# Altium schematic sheet mcu.SchDoc
size A4
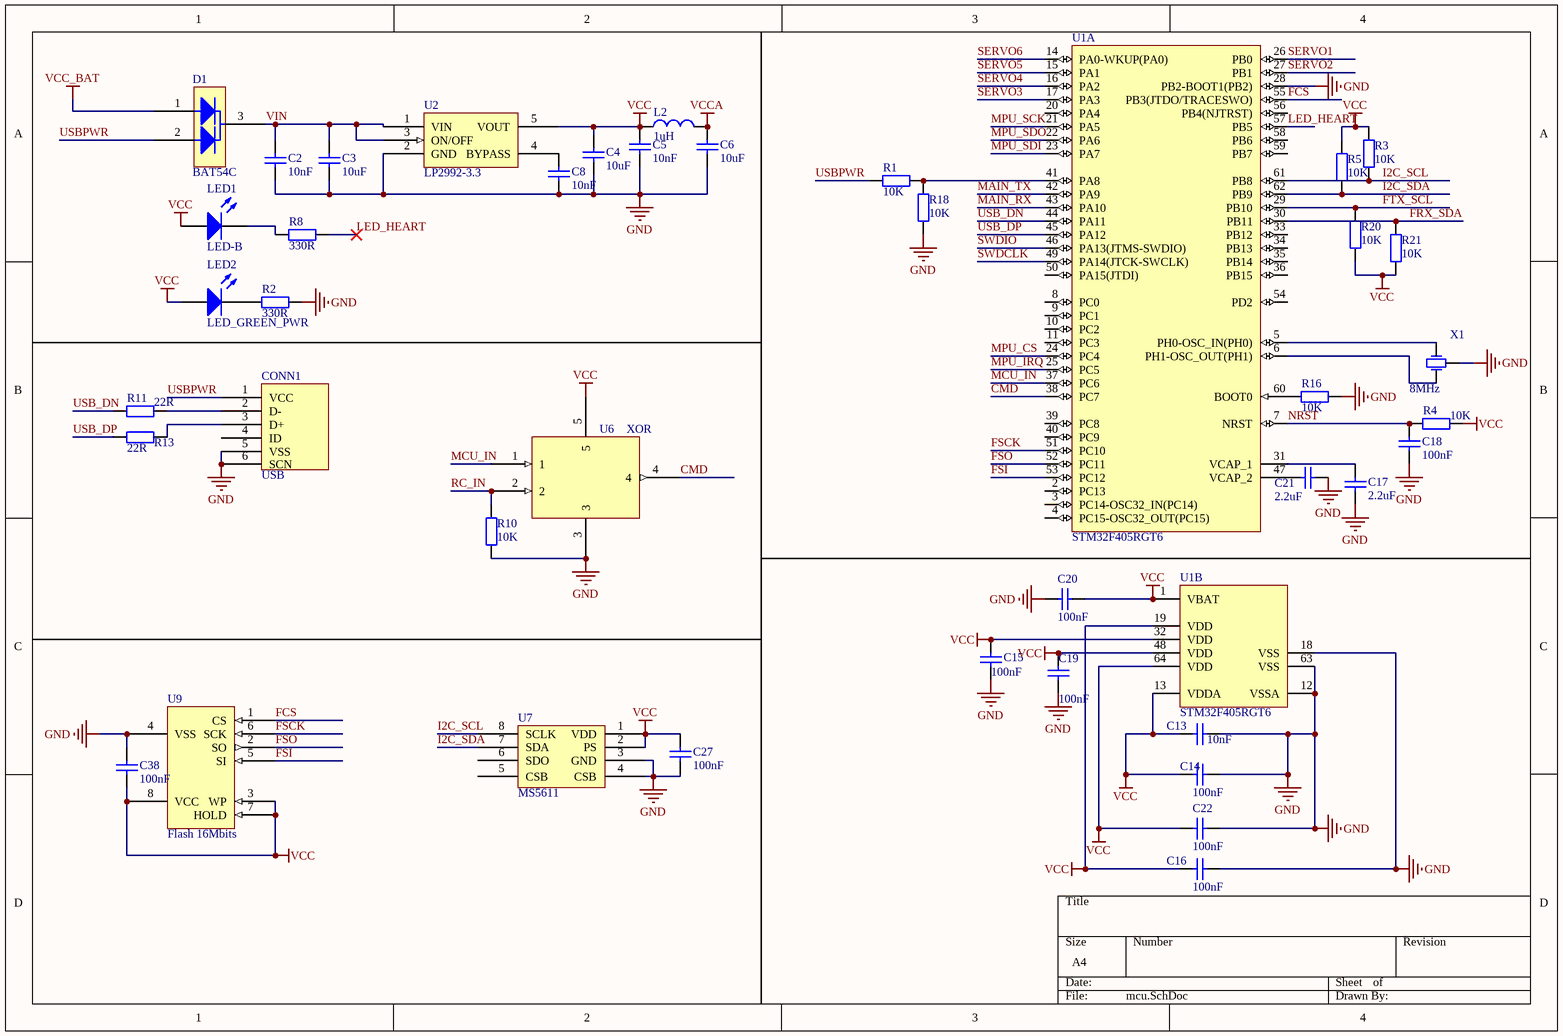
[diagram p0: mcu.SchDoc]

## Parts
C2  10nF  [0402C]
C3  10uF  [0805-1]
C4  10uF  [0805-1]
C5  10nF  [0402C]
C6  10uF  [0805-1]
C8  10nF  [0402C]
C13  10nF  [0402C]
C14  100nF  [0402C]
C15  100nF  [0402C]
C16  100nF  [0402C]
C17  2.2uF  [0402C]
C18  100nF  [0402C]
C19  100nF  [0402C]
C20  100nF  [0402C]
C21  2.2uF  [0402C]
C22  100nF  [0402C]
C27  100nF  [0402C]
C38  100nF  [0402C]
CONN1  USB  [USB_MIC_h]
D1  BAT54C  [SOT23]
L2  1uH  [L0603]
LED1  LED-B  [0402LED B]
LED2  LED_GREEN_PWR  [0402LED G]
R1  10K  [0402R]
R2  330R  [0402R]
R3  10K  [0402R]
R4  10K  [0402R]
R5  10K  [0402R]
R8  330R  [0402R]
R10  10K  [0402R]
R11  22R  [0402R]
R13  22R  [0402R]
R16  10K  [0402R]
R18  10K  [0402R]
R20  10K  [0402R]
R21  10K  [0402R]
U1  STM32F405RGT6  [STM-LQFP64_N]  (parts A,B of 2)
U2  LP2992-3.3  [SOT-23-5L]
U6  XOR  [SC70-5]
U7  MS5611  [MS5611-01BA]
U9  Flash 16Mbits  [SO8_N]
X1  8MHz  [XTAL3215]

## Nets
GND: C2.1 C3.1 C4.1 C5.1 C6.1 C8.1 C13.2 C14.2 C15.1 C16.2 C17.1 C18.1 C19.1 C20.1 C21.2 C22.2 C27.1 C38.2 CONN1.5(VSS) CONN1.6(SCN) R2.2 R10.1 R16.2 R18.1 U1.12(VSSA) U1.18(VSS) U1.28(PB2-BOOT1(PB2)) U1.63(VSS) U2.2(GND) U6.3 U7.3(GND) U7.4(CSB) U9.4(VSS) X1.2(GND)
VCC: C4.2 C5.2 C13.1 C14.1 C15.2 C16.1 C19.2 C20.2 C22.1 C27.2 C38.1 L2.1 LED1.1(A) LED2.1(A) R3.2 R4.2 R5.2 R20.1 R21.1 U1.1(VBAT) U1.13(VDDA) U1.19(VDD) U1.32(VDD) U1.48(VDD) U1.64(VDD) U2.5(VOUT) U6.5 U7.1(VDD) U7.2(PS) U9.3(WP) U9.7(HOLD) U9.8(VCC)
VCC_BAT: D1.1
VCCA: C6.2 L2.2
CMD: U1.38(PC7) U6.4
FCS: U1.55(PB3(JTDO/TRACESWO)) U9.1(CS)
FRX_SDA: R21.2 U1.30(PB11)
FSCK: U1.51(PC10) U9.6(SCK)
FSI: U1.53(PC12) U9.5(SI)
FSO: U1.52(PC11) U9.2(SO)
FTX_SCL: R20.2 U1.29(PB10)
I2C_SCL: R3.1 U1.61(PB8) U7.8(SCLK)
I2C_SDA: R5.1 U1.62(PB9) U7.7(SDA)
LED_HEART: R8.1 U1.57(PB5)
MAIN_RX: U1.43(PA10)
MAIN_TX: U1.42(PA9)
MCU_IN: U1.37(PC6) U6.1
MPU_CS: U1.24(PC4)
MPU_IRQ: U1.25(PC5)
MPU_SCK: U1.21(PA5)
MPU_SDI: U1.23(PA7)
MPU_SDO: U1.22(PA6)
NRST: C18.2 R4.1 U1.7(NRST)
RC_IN: R10.2 U6.2
SERVO1: U1.26(PB0)
SERVO2: U1.27(PB1)
SERVO3: U1.17(PA3)
SERVO4: U1.16(PA2)
SERVO5: U1.15(PA1)
SERVO6: U1.14(PA0-WKUP(PA0))
SWDCLK: U1.49(PA14(JTCK-SWCLK))
SWDIO: U1.46(PA13(JTMS-SWDIO))
USB_DN: R11.1 U1.44(PA11)
USB_DP: R13.1 U1.45(PA12)
USBPWR: CONN1.1(VCC) D1.2 R1.1
VIN: C2.2 C3.2 D1.3 U2.1(VIN) U2.3(ON/OFF)
NetC8_2: C8.2 U2.4(BYPASS)
NetC17_2: C17.2 U1.31(VCAP_1)
NetC21_1: C21.1 U1.47(VCAP_2)
NetCONN1_2: CONN1.2(D-) R11.2
NetCONN1_3: CONN1.3(D+) R13.2
NetLED1_2: LED1.2(K) R8.2
NetLED2_2: LED2.2(K) R2.1
NetR1_2: R1.2 R18.2 U1.41(PA8)
NetR16_1: R16.1 U1.60(BOOT0)
NetU1_5: U1.5(PH0-OSC_IN(PH0)) X1.3(OSC2)
NetU1_6: U1.6(PH1-OSC_OUT(PH1)) X1.1(OSC1)

Not connected (* = marked no-connect by the designer): CONN1 4(ID); U1 2(PC13) 3(PC14-OSC32_IN(PC14)) 4(PC15-OSC32_OUT(PC15)) 8(PC0) 9(PC1) 10(PC2) 11(PC3) 20(PA4) 33(PB12) 34(PB13) 35(PB14) 36(PB15) 39(PC8) 40(PC9) 50(PA15(JTDI)) 54(PD2) 56(PB4(NJTRST)) 58(PB6) 59(PB7); U7 5(CSB) 6(SDO)

## Library data of the parts
C2-C6 C8 C13-C22 C27 C38 = cap: 贴片电阻
CONN1 = USB-MIC: USB Micro USB R/A Type B
D1 = BAT54C: Dual Diode Command Cathode BAT54C
L2 = inducer: 贴片电感
LED1 = LED-B: LED-BLUE
LED2 = LED_GREEN: 绿色led
R1-R5 R8 R10 R11 R13 R16 R18 R20 R21 = Res-0402: 贴片电阻
U1 = STM32F405RGT6: ARM Cortex-M4 32-bit MCU+FPU, 210 DMIPS, 1024 kB Flash, 192 kB Internal RAM, 51 I/Os, 64-pin LQFP, -40 to 85 degC, Tray; Manufacturer: STMicroelectronics; D/A Converter: 2x12-bit; FLASH Size (Prog) (kB): 1024; I/Os (High Current): 51; Internal RAM Size (kB): 192; Operating Frequency(F) (Processor speed) (MHz): 168; Supply Voltage(Vcc) max (V): 3.6; Supply Voltage(Vcc) min (V): 1.8; DatasheetVersion: Rev. 4; PackageVersion: Rev. 4, 06/2013; PackageReference: LQFP64; PackageDescription: 64-Pin Low Profile Quad Flat Package, 10 x 10 mm Body, 0.5 mm Pitch; Supplier 1: Digi-Key; Supplier Part Number 1: 497-11767-ND; Supplier 2: Farnell; Supplier Part Number 2: 2064363; Supplier 3: Newark; Supplier Part Number 3: 73T2329; Supplier 4: Mouser; Supplier Part Number 4: 511-STM32F405RGT6; Core: ARM Cortex-M4; Packing: Tray; Mounting Technology: Surface Mount; PartNumber: STM32F405RGT6; ComponentLink1Description: Manufacturer URL; ComponentLink1URL: http://www.st.com/web/en/home.html; ComponentLink2Description: Datasheet; ComponentLink2URL: http://www.st.com/st-web-ui/static/active/en/resource/technical/document/datasheet/DM00037051.pdf; ComponentLink3Description: Package Specification; ComponentLink3URL: http://www.st.com/st-web-ui/static/active/en/resource/technical/document/datasheet/DM00037051.pdf
U2 = LP2992-3.3: LP2992IM5-3.3/NOPBCT-ND
U6 = XOR: XOR Gate SN74LVC1G86DCKR
U7 = MS5611: MS561101BA03
U9 = Flash: 16Mbit SPI Flash Memory
X1 = XTAL-3215